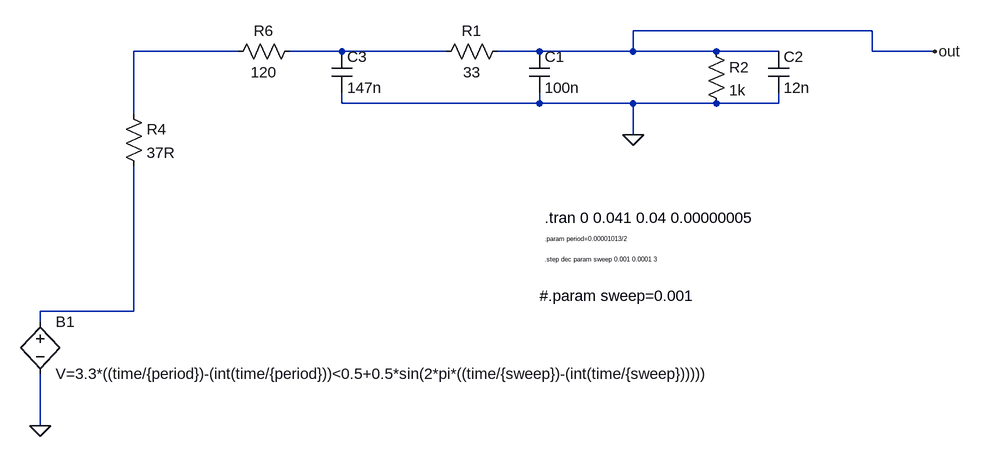
[diagram p0: schematic PiezoOut.asc]
PiezoOut.asc, the LTspice schematic file:
Version 4
SHEET 1 6680 708
WIRE 592 80 224 80
WIRE -384 112 -544 112
WIRE -224 112 -304 112
WIRE -64 112 -224 112
WIRE 80 112 16 112
WIRE 224 112 224 80
WIRE 224 112 80 112
WIRE 352 112 224 112
WIRE 448 112 352 112
WIRE 592 112 592 80
WIRE 688 112 592 112
WIRE -224 192 -224 176
WIRE 80 192 80 176
WIRE 80 192 -224 192
WIRE 224 192 80 192
WIRE 352 192 224 192
WIRE 448 192 448 176
WIRE 448 192 352 192
WIRE -544 208 -544 112
WIRE 224 240 224 192
WIRE -544 512 -544 288
WIRE -544 512 -688 512
WIRE -688 528 -688 512
WIRE -688 688 -688 608
FLAG 688 112 out
FLAG -688 688 0
FLAG 224 240 0
SYMBOL res 32 96 R90
WINDOW 0 0 56 VBottom 2
WINDOW 3 32 56 VTop 2
SYMATTR InstName R1
SYMATTR Value 33
SYMBOL cap 64 112 R0
SYMATTR InstName C1
SYMATTR Value 100n
SYMBOL bv -688 512 R0
SYMATTR InstName B1
SYMATTR Value V=3.3*((time/{period})-(int(time/{period}))<0.5+0.5*sin(2*pi*((time/{sweep})-(int(time/{sweep})))))
SYMBOL res -560 192 R0
SYMATTR InstName R4
SYMATTR Value 37R
SYMBOL res -288 96 R90
WINDOW 0 0 56 VBottom 2
WINDOW 3 32 56 VTop 2
SYMATTR InstName R6
SYMATTR Value 120
SYMBOL cap -240 112 R0
SYMATTR InstName C3
SYMATTR Value 147n
SYMBOL cap 432 112 R0
SYMATTR InstName C2
SYMATTR Value 12n
SYMBOL res 336 96 R0
SYMATTR InstName R2
SYMATTR Value 1k
TEXT 88 368 Left 2 !.tran 0 0.041 0.04 0.00000005
TEXT 88 400 Left 0 !.param period=0.00001013/2
TEXT 88 432 Left 0 !.step dec param sweep 0.001 0.0001 3
TEXT 80 488 Left 2 !#.param sweep=0.001

The netlist it stands for:
* PiezoOut.asc
R1 out N002 33
C1 out 0 100n
B1 N003 0 V=3.3*((time/{period})-(int(time/{period}))<0.5+0.5*sin(2*pi*((time/{sweep})-(int(time/{sweep})))))
R4 N001 N003 37R
R6 N002 N001 120
C3 N002 0 147n
C2 out 0 12n
R2 out 0 1k
.tran 0 0.041 0.04 0.00000005
.param period=0.00001013/2
.step dec param sweep 0.001 0.0001 3
#.param sweep=0.001
.backanno
.end